# Altium schematic sheet FPGA.SchDoc
size A4
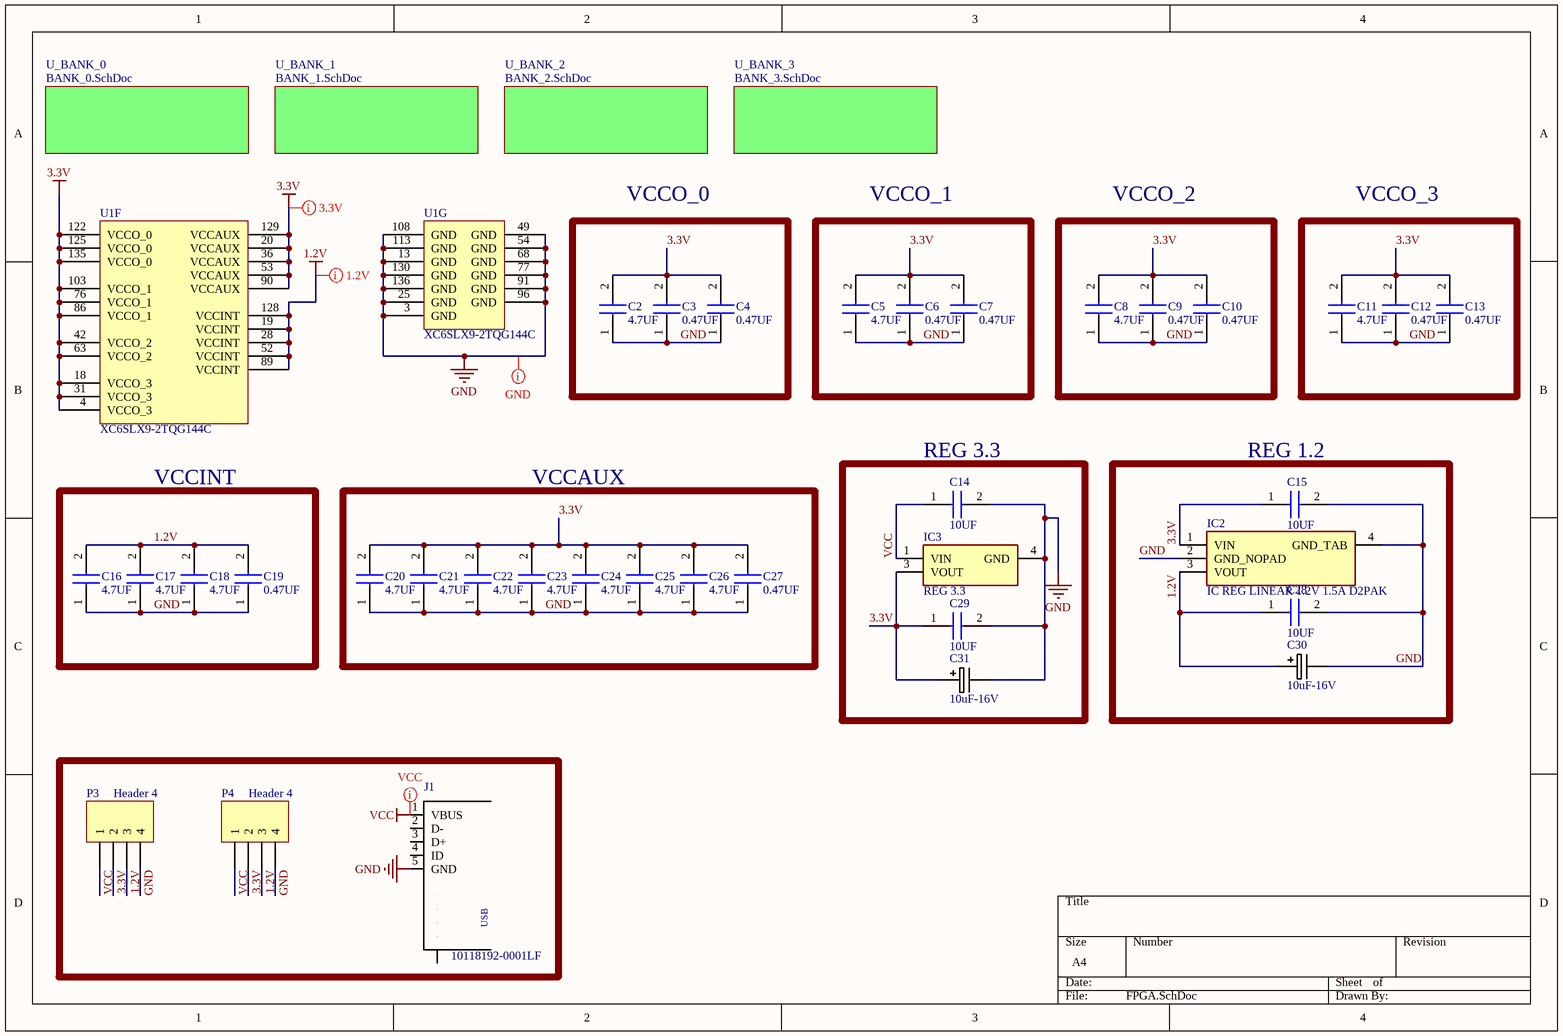
[diagram p0: FPGA.SchDoc]

## Parts
C2  4.7UF  [CAPC2012X135N]
C3  0.47UF  [CAPC2012X135N]
C4  0.47UF  [CAPC2012X135N]
C5  4.7UF  [CAPC2012X135N]
C6  0.47UF  [CAPC2012X135N]
C7  0.47UF  [CAPC2012X135N]
C8  4.7UF  [CAPC2012X135N]
C9  0.47UF  [CAPC2012X135N]
C10  0.47UF  [CAPC2012X135N]
C11  4.7UF  [CAPC2012X135N]
C12  0.47UF  [CAPC2012X135N]
C13  0.47UF  [CAPC2012X135N]
C14  10UF  [CAPC2012X135N]
C15  10UF  [CAPC2012X135N]
C16  4.7UF  [CAPC2012X135N]
C17  4.7UF  [CAPC2012X135N]
C18  4.7UF  [CAPC2012X135N]
C19  0.47UF  [CAPC2012X135N]
C20  4.7UF  [CAPC2012X135N]
C21  4.7UF  [CAPC2012X135N]
C22  4.7UF  [CAPC2012X135N]
C23  4.7UF  [CAPC2012X135N]
C24  4.7UF  [CAPC2012X135N]
C25  4.7UF  [CAPC2012X135N]
C26  4.7UF  [CAPC2012X135N]
C27  0.47UF  [CAPC2012X135N]
C28  10UF  [CAPC2012X135N]
C29  10UF  [CAPC2012X135N]
C30  10uF-16V  [PANACAP-b]
C31  10uF-16V  [PANACAP-b]
IC2  IC REG LINEAR 1.2V 1.5A D2PAK  [TO254P1420X457-4N]
IC3  REG 3.3  [NCV8674DS50R4G]
J1  10118192-0001LF  [10118192-0001LF_10118192-0001LF(Primary)]
P3  Header 4  [HDR1X4]
P4  Header 4  [HDR1X4]
U1  XC6SLX9-2TQG144C  [TQG144_N]  (parts F,G of 7)

## Blocks framed on the sheet
VCCO_0: C2-C4
VCCO_1: C5-C7
VCCO_2: C8-C10
VCCO_3: C11-C13
VCCINT: C16-C19
VCCAUX: C20-C27
REG 3.3: C14 C29 C31 IC3
REG 1.2: C15 C28 C30 IC2

## Sub-sheets
U_BANK_0 = BANK_0.SchDoc: no entries
U_BANK_1 = BANK_1.SchDoc: no entries
U_BANK_2 = BANK_2.SchDoc: no entries
U_BANK_3 = BANK_3.SchDoc: no entries

## Nets
1.2V: C16.2 C17.2 C18.2 C19.2 C28.1 C30.+ IC2.3(VOUT) P3.3 P4.3 U1.19(VCCINT) U1.28(VCCINT) U1.52(VCCINT) U1.89(VCCINT) U1.128(VCCINT)
3.3V: C2.2 C3.2 C4.2 C5.2 C6.2 C7.2 C8.2 C9.2 C10.2 C11.2 C12.2 C13.2 C15.1 C20.2 C21.2 C22.2 C23.2 C24.2 C25.2 C26.2 C27.2 C29.1 C31.+ IC2.1(VIN) IC3.3(VOUT) P3.2 P4.2 U1.4(VCCO_3) U1.18(VCCO_3) U1.20(VCCAUX) U1.31(VCCO_3) U1.36(VCCAUX) U1.42(VCCO_2) U1.53(VCCAUX) U1.63(VCCO_2) U1.76(VCCO_1) U1.86(VCCO_1) U1.90(VCCAUX) U1.103(VCCO_1) U1.122(VCCO_0) U1.125(VCCO_0) U1.129(VCCAUX) U1.135(VCCO_0)
GND: C2.1 C3.1 C4.1 C5.1 C6.1 C7.1 C8.1 C9.1 C10.1 C11.1 C12.1 C13.1 C14.2 C15.2 C16.1 C17.1 C18.1 C19.1 C20.1 C21.1 C22.1 C23.1 C24.1 C25.1 C26.1 C27.1 C28.2 C29.2 C30.- C31.- IC2.2(GND_NOPAD) IC2.4(GND_TAB) IC3.4(GND) J1.5(GND) P3.4 P4.4 U1.3(GND) U1.13(GND) U1.25(GND) U1.49(GND) U1.54(GND) U1.68(GND) U1.77(GND) U1.91(GND) U1.96(GND) U1.108(GND) U1.113(GND) U1.130(GND) U1.136(GND)
VCC: C14.1 IC3.1(VIN) J1.1(VBUS) P3.1 P4.1

Not connected (* = marked no-connect by the designer): J1 2(D-) 3(D+) 4(ID) M1(S) M2(S) S1(S) S2(S) S3(S) S4(S)

## Layout directives
rule Width Constraint [Pref Width = 15.748mil    Min Width = 11.811mil    Max Width = 15.748mil]: 1.2V, 3.3V, GND, VCC

## Notes on the sheet
- (in symbol 10118192-0001LF) USB

## Library data of the parts
C2 C5 C8 C11 C16-C18 C20-C26 = CAP CER 4.7UF 16V X5R 0805: Capacitor; Manufacturer_Name: Wurth Elektronik; Manufacturer_Part_Number: 885012107013; Datasheet Link: https://katalog.we-online.com/pbs/datasheet/885012107013.pdf; Height: 1.35mm; Mouser Part Number: 710-885012107013; Mouser Price/Stock: https://www.mouser.com/Search/Refine.aspx?Keyword=710-885012107013; RS Part Number: 1814065P; RS Price/Stock: http://uk.rs-online.com/web/p/products/1814065P
C3 C4 C6 C7 C9 C10 C12 C13 C19 C27 = CAP CER 0.47UF 16V X7R 0805: Capacitor; Manufacturer_Name: Wurth Elektronik; Manufacturer_Part_Number: 885012207049; Datasheet Link: https://katalog.we-online.com/pbs/datasheet/885012207049.pdf; Height: 1.35mm; Mouser Part Number: 710-885012207049; Mouser Price/Stock: https://www.mouser.com/Search/Refine.aspx?Keyword=710-885012207049
C14 C15 C28 C29 = CAP CER 10UF 16V X5R 0805: Capacitor; Manufacturer_Name: Wurth Elektronik; Manufacturer_Part_Number: 885012107013; Datasheet Link: https://katalog.we-online.com/pbs/datasheet/885012107013.pdf; Height: 1.35mm; Mouser Part Number: 710-885012107013; Mouser Price/Stock: https://www.mouser.com/Search/Refine.aspx?Keyword=710-885012107013; RS Part Number: 1814065P; RS Price/Stock: http://uk.rs-online.com/web/p/products/1814065P
C30 C31 = PANACAP-10UF-16V-FK: GENERIC CAPACITOR POLARISED; Supplier 1: Digi-Key; Supplier Part Number 1: PCE3782TR-ND
IC2 = IC REG LINEAR 1.2V 1.5A D2PAK: Integrated Circuit; Manufacturer_Name: ON Semiconductor; Manufacturer_Part_Number: NCP565D2T12G; Allied_Number: 70340882; Datasheet Link: http://www.onsemi.com/pub/Collateral/NCP565-D.PDF; Height: 4.572mm; Mouser Part Number: 863-NCP565D2T12G; Mouser Price/Stock: https://www.mouser.com/Search/Refine.aspx?Keyword=863-NCP565D2T12G; RS Part Number: 0464164; RS Price/Stock: http://uk.rs-online.com/web/p/products/0464164; Allied Price/Stock: http://www.alliedelec.com/on-semiconductor-ncp565d2t12g/70340882/
IC3 = IC REG LINEAR 3.3V 1.5A D2PAK: Integrated Circuit; Manufacturer_Name: ON Semiconductor; Manufacturer_Part_Number: NCP565D2T33R4G; Datasheet Link: https://www.onsemi.com/pub/Collateral/NCP565-D.PDF; Height: 4mm; Mouser Part Number: 863-NCP565D2T33R4G; Mouser Price/Stock: https://www.mouser.com/Search/Refine.aspx?Keyword=863-NCP565D2T33R4G; RS Part Number: 7852432P; RS Price/Stock: http://uk.rs-online.com/web/p/products/7852432P
J1 = 10118192-0001LF: Conn Micro USB Type B RCP 5 POS 0.65mm Solder RA SMD 5 Terminal 1 Port T/R; MF: Amphenol; Price: 0.23 USD; MP: 10118192-0001LF; Availability: Good; SnapEDA_Link: https://www.snapeda.com/parts/10118192-0001LF/Amphenol%20Solar/view-part/?ref=snap; Package: None; Value: *
P3 P4 = Header 4: Header, 4-Pin; LatestRevisionDate: 17-Jul-2002; LatestRevisionNote: Re-released for DXP Platform.; Publisher: Altium Limited
U1 = XC6SLX9-2TQG144C: Spartan-6 LX 1.2V FPGA, 102 User I/Os, 144-Pin TQFP (0.5mm Pitch), Speed Grade 2, Commercial Grade, Pb-Free; DatasheetVersion: ver1.6, Nov-2010; PackageVersion: ver1.2, Jun-2004; PackageReference: TQG144; PackageDescription: 144-Pin Thin Quad Flat Pack (TQG144) - Pb-Free; Code_JEDEC: MS-026-BFB; ComponentLink1Description: Manufacturer URL; ComponentLink1URL: http://www.xilinx.com/; ComponentLink2Description: Spartan-6 Datasheet; ComponentLink2URL: http://www.xilinx.com/support/documentation/data_sheets/ds160.pdf; ComponentLink3Description: Spartan-6 Documents; ComponentLink3URL: http://www.xilinx.com/support/documentation/spartan-6.htm